# Altium schematic sheet Standard Module Comms.SchDoc
size A; SheetNumber: 8; SheetTotal: 10
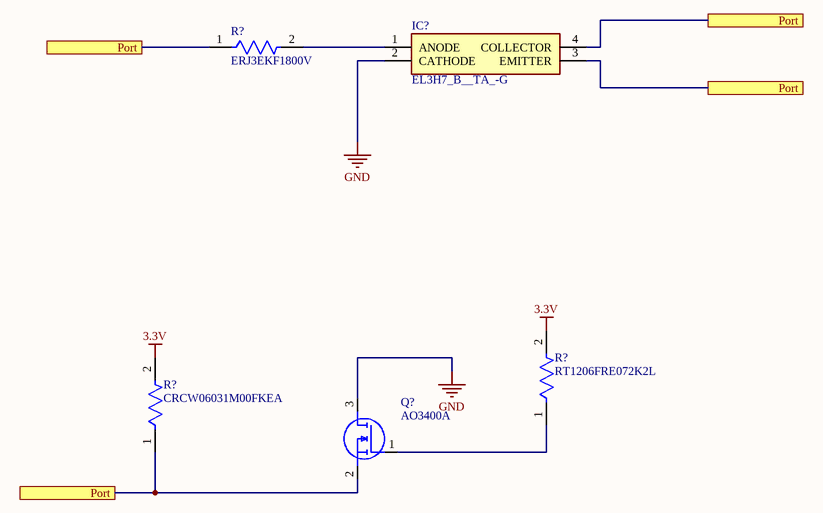
[diagram p0: Standard Module Comms.SchDoc]

## Parts
(Parts that share a designator on the sheet are numbered #1, #2 ... from top to bottom, then left to right.)
IC?  EL3H7_B__TA_-G  [SOIC127P700X200-4N]
Q?  AO3400A  [SOT95P280X125-3N]
R?#1  ERJ3EKF1800V  [FP-ERJ3EK-MFG]
R?#2  RT1206FRE072K2L  [FP-RT1206-MFG]
R?#3  CRCW06031M00FKEA  [FP-CRCW0603-e3-IPC_A]

## Ports
Port

## Nets
3.3V: R?#2.2 R?#3.2
GND: IC?.2(CATHODE) Q?.3(D)
Port: IC?.3(EMITTER) IC?.4(COLLECTOR) Q?.2(S) R?#1.1 R?#3.1 ; port Port
NetIC?_1: IC?.1(ANODE) R?#1.2
NetQ?_1: Q?.1(G) R?#2.1

## Library data of the parts
IC? = EL3H7_B__TA_-G: Integrated Circuit; Manufacturer_Name: Everlight; Manufacturer_Part_Number: EL3H7(B)(TA)-G; Datasheet Link: https://www.arrow.com/en/products/el3h7-b-ta-g/everlight-electronics?region=nac; Height: 2mm; Mouser Part Number: 638-EL3H7BTAG; Mouser Price/Stock: https://www.mouser.co.uk/ProductDetail/Everlight/EL3H7BTA-G?qs=8PzhAHr7IdM%252B0XGOXhFFCg%3D%3D; Arrow Part Number: EL3H7(B)(TA)-G; Arrow Price/Stock: https://www.arrow.com/en/products/el3h7-b-ta-g/everlight-electronics?region=nac
Q? = AO3400A: MOSFET (N-Channel); Manufacturer_Name: Alpha & Omega Semiconductors; Datasheet Link: http://aosmd.com/res/data_sheets/AO3400A.pdf; Height: 1.25mm; Manufacturer_Part_Number: AO3400A; Arrow Part Number: AO3400A; Arrow Price/Stock: https://www.arrow.com/en/products/ao3400a/alpha-and-omega-semiconductor?region=europe
R?#1 = CMP-2000-00293-2: RES SMD 180 OHM 1% 1/10W 0603; Manufacturer: Panasonic; Value: 180Ω; Power Rating: 0.1W; Temperature Coefficient: 100ppm/°C; Voltage Rating: 75V; Automotive Grade: Grade 0; Description: 180 Ohms ±1% 0.1W, 1/10W Chip Resistor 0603 (1608 Metric) Automotive AEC-Q200 Thick Film; Digikey Description: RES SMD 180 OHM 1% 1/10W 0603; Series: ERJ; Octopart: https://octopart.com/erj-3ekf1800v-panasonic-55421532; Footprint Url: https://industrial.panasonic.com/cdbs/www-data/pdf/RDA0000/DMA0000COL17.pdf; Temperature: -55°C to +155°C; ComponentLink2Description: Datasheet; Device Class L3: Chip SMD Resistors; Temperature Range High: +155°C; RoHS: TRUE; Category: Res; Device Class L2: Resistors; Package: ERJ3EK; Mouser Description: Thick Film Resistors 0603 180ohms 1% AEC-Q200; Manufacturer Part Number: ERJ3EKF1800V; Resistance: 180Ω; Temperature Range Low: -55°C; Device Class L1: Passive Components; Automotive: Yes; ComponentLink2URL: https://industrial.panasonic.com/cdbs/www-data/pdf/RDA0000/AOA0000C304.pdf; Tolerance: 1%; Lead Free: Yes; Composition: Thick Film; Height: 0.55mm
R?#2 = CMP-2003-04309-2: RES SMD 2.2K OHM 1% 1/4W 1206; Manufacturer: Yageo; Power Rating: 0.25W; Resistance: 2.2KΩ; Tolerance: 0.0002; Temperature Coefficient: 50 ppm/°C; Description: RT1206 2.2KΩ 0.25W 50 ppm/°C 0.02%; Value: 2.2KΩ; Voltage Rating: 200V; Device Class L3: Chip SMD Resistors; Temperature: -55°C to +155°C; Digikey Description: RES SMD 2.2K OHM 1% 1/4W 1206; Height: 0.65mm; Manufacturer Part Number: RT1206FRE072K2L; ComponentLink2URL: http://www.yageo.com/documents/recent/PYu-RT_1-to-0.01_RoHS_L_9.pdf; Device Class L1: Passive Components; Ipc Land Pattern Name: RESC310160X55; Octopart: https://octopart.com/rt1206fre072k2l-yageo-1275907; Device Class L2: Resistors; Series: RT; Automotive: No; Temperature Range Low: -55°C; RoHS: TRUE; Category: Res; Temperature Range High: +155°C; ComponentLink2Description: Datasheet; Package: RT1206; Lead Free: Yes; Footprint Url: http://www.yageo.com/exep/pages/download/literatures/PYu-R_Mount_10.pdf; Mouser Description: High Precision-High Stability Chip Resistor Thin Film 1206 2.2kOhm 1% Paper T/R; Composition: Thin Film
R?#3 = CMP-2000-03013-2: RES Thick Film, 1MΩ, 1%, 0.1W, 100ppm/°C, 0603; Max Power Dissipation: 100mW; Resistance: 1MR; Voltage Rating (DC): 75V; Depth: 0.85mm; Max Operating Temperature: 155°C; Length: 1.55mm; Power Rating: 100mW; Military Standard: Not; Features: Automotive AEC-Q200; Min Operating Temperature: -55°C; Number of Pins: 2; Mount: Surface Mount; Package Quantity: 10; Packaging: Tape and Reel; Height: 0.45mm; Radiation Hardening: No; Case Code (Metric): 1608; Temperature Coefficient: 100ppm/°C; Width: 0.85mm; Composition: Thick Film; Termination: SMD/SMT; Tolerance: 1%; Number of Terminations: 2; Lead Free: Lead Free; Contact Plating: Tin; Case/Package: 0603; Weight: 7.1E-05oz; Voltage Rating: 75V; Case Code (Imperial): 0603